# Altium project Test1.PrjPcb
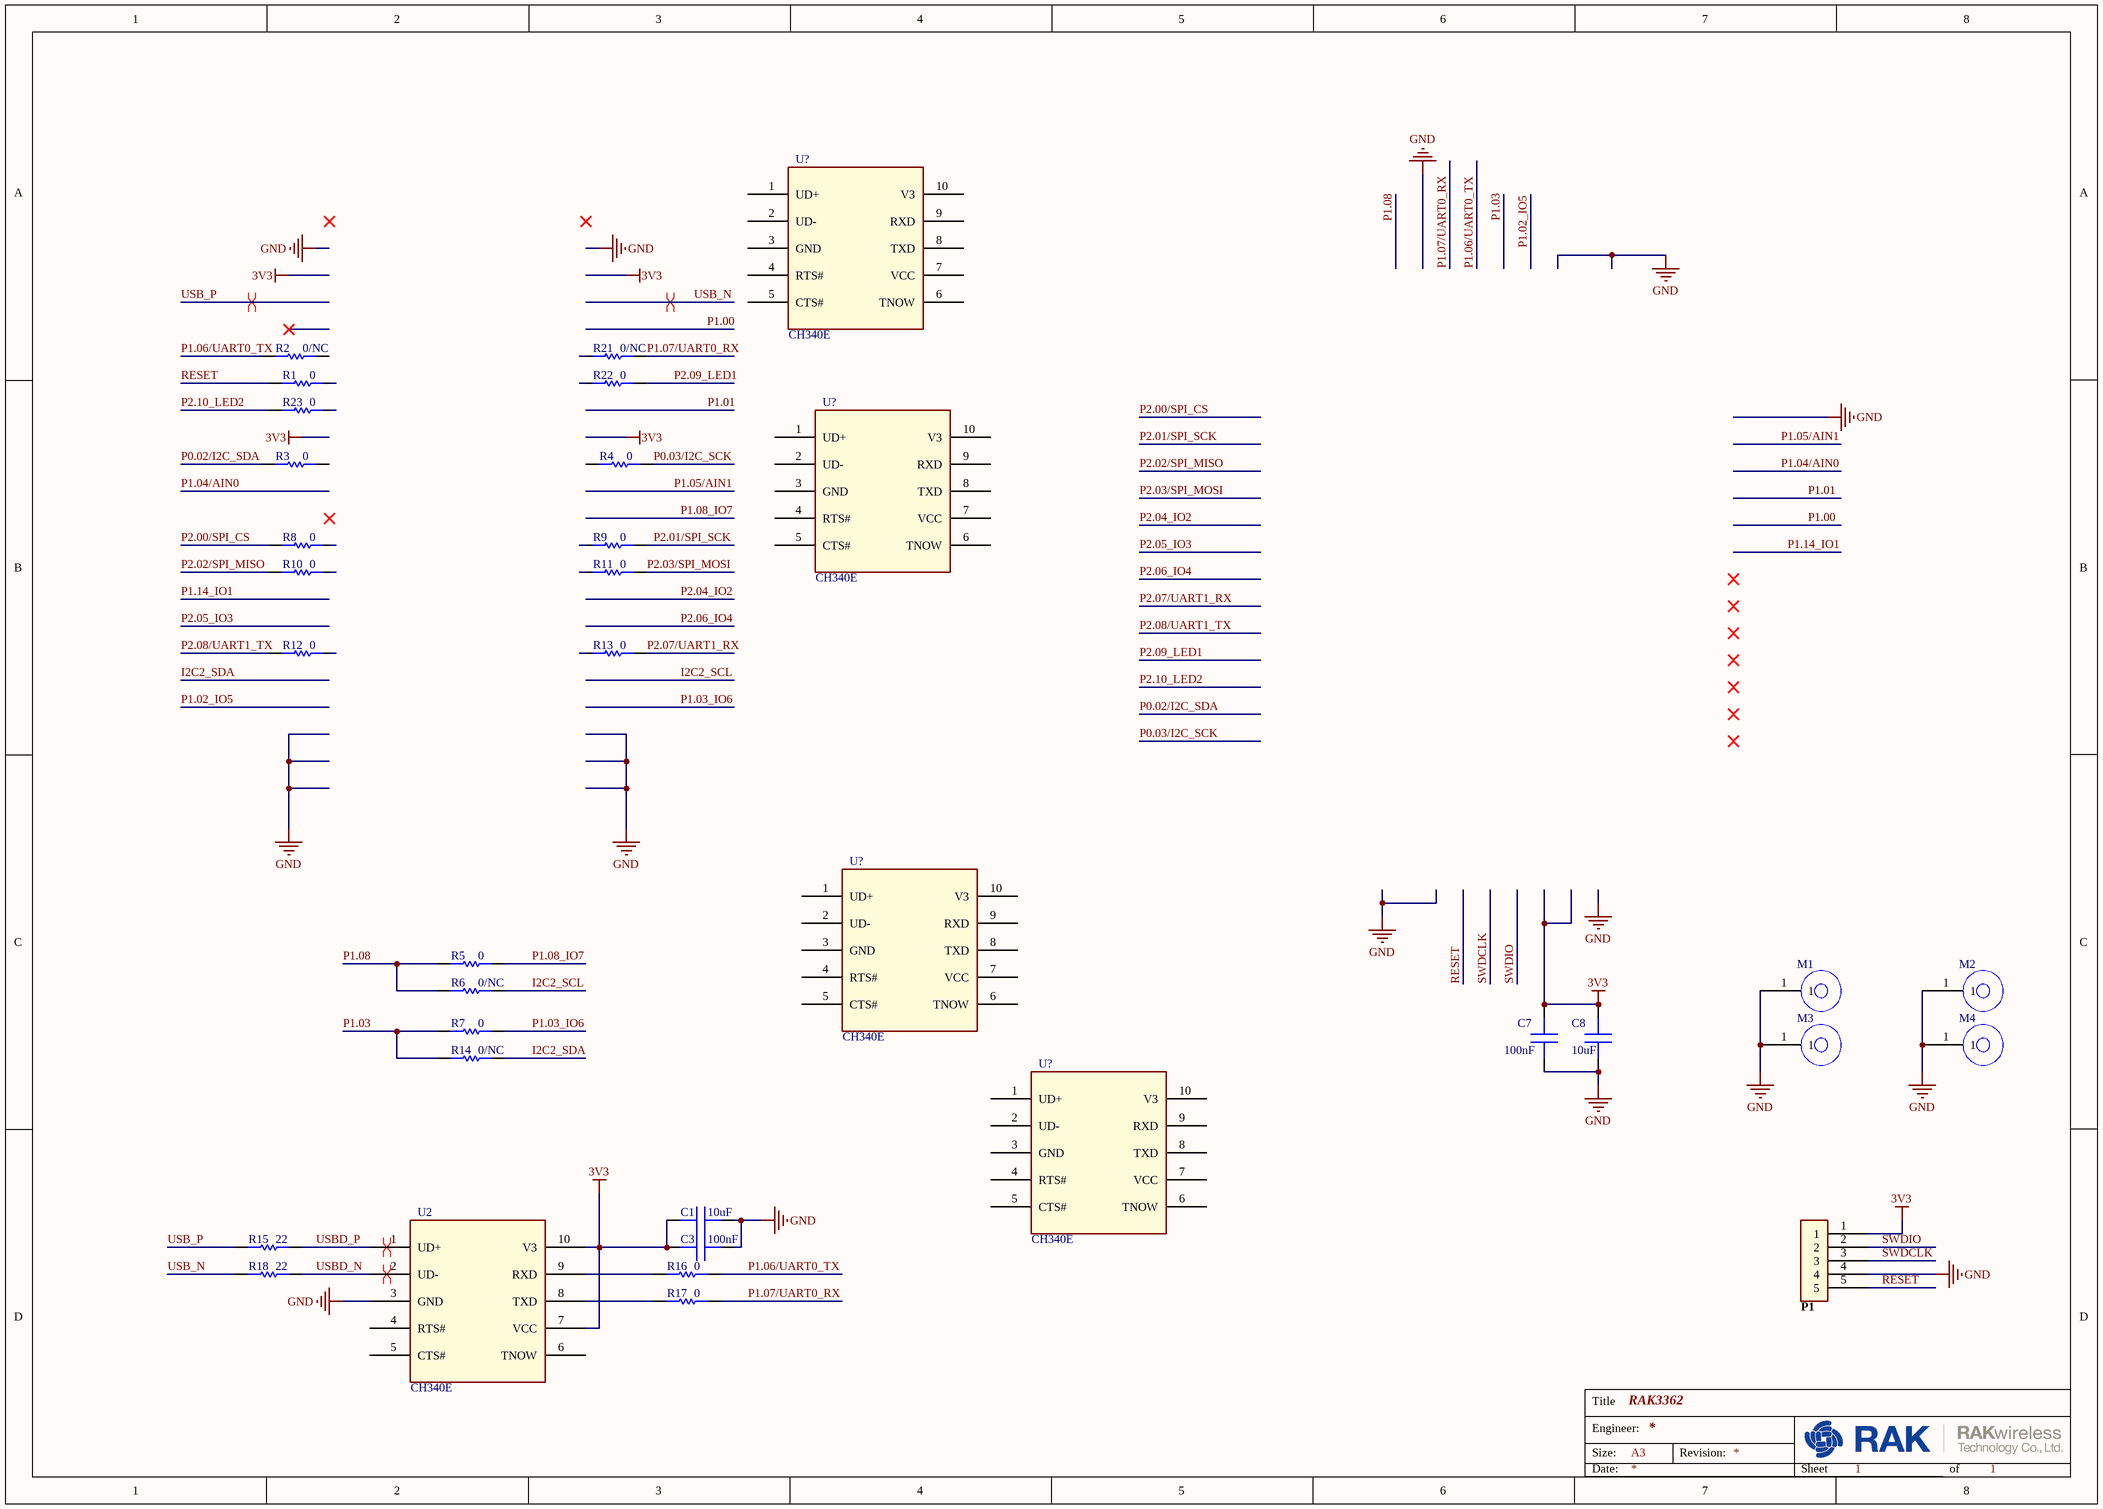
[diagram p0: RAK3362_VB_260330.SchDoc]
1 sheet, 35 parts. Net scope: global (net labels, ports and power ports of the same name join across sheets).
Board file: RAK3362_VB_260329_1.PcbDoc

## Sheet RAK3362_VB_260330.SchDoc: RAK3362
size A3; SheetNumber: 1; SheetTotal: 1

### Parts
(Parts that share a designator on the sheet are numbered #1, #2 ... from top to bottom, then left to right.)
C1  value 10uF  [sc0402]  (hidden comment: CAPACITOR NP)
C3  value 100nF  [sc0402]  (hidden comment: CAPACITOR NP)
C7  value 100nF  [sc0402]  (hidden comment: CAPACITOR NP)
C8  value 10uF  [sc0402]  (hidden comment: CAPACITOR NP)
M1  LuoDingK  [M15_26]  (value not drawn)
M2  LuoDingK  [M15_26]  (value not drawn)
M3  LuoDingK  [M15_26]  (value not drawn)
M4  LuoDingK  [M15_26]  (value not drawn)
P1  Header1X5  [PH254-115-05]  (value not drawn)
R1  value 0  [sr0402]  (hidden comment: RESISTOR)
R2  value 0/NC  [sr0402]  (hidden comment: RESISTOR)
R3  value 0  [sr0402]  (hidden comment: RESISTOR)
R4  value 0  [sr0402]  (hidden comment: RESISTOR)
R5  value 0  [sr0402]  (hidden comment: RESISTOR)
R6  value 0/NC  [sr0402]  (hidden comment: RESISTOR)
R7  value 0  [sr0402]  (hidden comment: RESISTOR)
R8  value 0  [sr0402]  (hidden comment: RESISTOR)
R9  value 0  [sr0402]  (hidden comment: RESISTOR)
R10  value 0  [sr0402]  (hidden comment: RESISTOR)
R11  value 0  [sr0402]  (hidden comment: RESISTOR)
R12  value 0  [sr0402]  (hidden comment: RESISTOR)
R13  value 0  [sr0402]  (hidden comment: RESISTOR)
R14  value 0/NC  [sr0402]  (hidden comment: RESISTOR)
R15  value 22  [sr0402]  (hidden comment: RESISTOR)
R16  value 0  [sr0402]  (hidden comment: RESISTOR)
R17  value 0  [sr0402]  (hidden comment: RESISTOR)
R18  value 22  [sr0402]  (hidden comment: RESISTOR)
R21  value 0/NC  [sr0402]  (hidden comment: RESISTOR)
R22  value 0  [sr0402]  (hidden comment: RESISTOR)
R23  value 0  [sr0402]  (hidden comment: RESISTOR)
U2  CH340E  [MSOP-10]
U?#1  CH340E  [MSOP-10]
U?#2  CH340E  [MSOP-10]
U?#3  CH340E  [MSOP-10]
U?#4  CH340E  [MSOP-10]

### Nets
3V3: C1.2(NEG) C3.1(POS) C7.2(NEG) C8.2(NEG) P1.1 U2.7(VCC) U2.10(V3)
GND: C1.1(POS) C3.2(NEG) C7.1(POS) C8.1(POS) M1.1 M2.1 M3.1 M4.1 P1.4 U2.3(GND)
I2C2_SCL: R6.1
I2C2_SDA: R14.1
P0.02/I2C_SDA: R3.2
P0.03/I2C_SCK: R4.1
P1.03: R7.2 R14.2
P1.03_IO6: R7.1
P1.06/UART0_TX: R2.2 R16.1
P1.07/UART0_RX: R17.1 R21.1
P1.08: R5.2 R6.2
P1.08_IO7: R5.1
P2.00/SPI_CS: R8.2
P2.01/SPI_SCK: R9.1
P2.02/SPI_MISO: R10.2
P2.03/SPI_MOSI: R11.1
P2.07/UART1_RX: R13.1
P2.08/UART1_TX: R12.2
P2.09_LED1: R22.1
P2.10_LED2: R23.2
RESET: P1.5 R1.2
SWDCLK: P1.3
SWDIO: P1.2
USB_N: R18.2
USB_P: R15.2
USBD_N: R18.1 U2.2(UD-)
USBD_P: R15.1 U2.1(UD+)
NetR16_2: R16.2 U2.9(RXD)
NetR17_2: R17.2 U2.8(TXD)

Not connected (* = marked no-connect by the designer): R1 1; R2 1; R3 1; R4 2; R8 1; R9 2; R10 1; R11 2; R12 1; R13 2; R21 2; R22 2; R23 1; U2 4(RTS#) 5(CTS#) 6(TNOW); U?#1 1(UD+) 2(UD-) 3(GND) 4(RTS#) 5(CTS#) 6(TNOW) 7(VCC) 8(TXD) 9(RXD) 10(V3); U?#2 1(UD+) 2(UD-) 3(GND) 4(RTS#) 5(CTS#) 6(TNOW) 7(VCC) 8(TXD) 9(RXD) 10(V3); U?#3 1(UD+) 2(UD-) 3(GND) 4(RTS#) 5(CTS#) 6(TNOW) 7(VCC) 8(TXD) 9(RXD) 10(V3); U?#4 1(UD+) 2(UD-) 3(GND) 4(RTS#) 5(CTS#) 6(TNOW) 7(VCC) 8(TXD) 9(RXD) 10(V3)

### Layout directives
differential pair: USB_N, USB_P, USBD_N, USBD_P

### Notes on the sheet
- Title
- Size:
- Engineer:
- A3
- Revision:
- Date:
- Sheet
- of

### Library data of the parts
C1 C8 = 0807C004: Capacitor-10V-10uF-±20%-X5R-0402; MANUFACTURER: YAGEO; Part Number: CC0402MRX5R6BB106; TOLERANCE: ±20%; SYMNAME: CAP; VOLTAGE: 10V; RAK Code: KRAKBJ0807C004; Classification: SMD Ceramic Capacitor; CODE: 0807C004
C3 C7 = 08070561: Capacitor-10V-100nF-±10%-X5R -0402; MANUFACTURER: YAGEO; Part Number: CC0402KRX5R6BB104; TOLERANCE: ±10%; SYMNAME: CAP; VOLTAGE: 10V; RAK Code: K3CA10402KA402; Classification: SMD Ceramic Capacitor; CODE: 08070561
M1-M4 = 2699C004: Mounting Hole-Hole 1.5mm-Pad 2.6mm; Value: NC; Code: 2699C004; Classification: Mounting Hole
R1-R14 R16 R17 R21-R23 = 07090800: Resistor-0Ω-1A-50mΩMAX-0402; MANUFACTURER: YAGEO; Part Number: RC0402JR-070RL; RAK Code: K3RS00001JA402; Tolerance: < 50mΩ; Classification: Thick Film Resistor; CODE: 07090800
R15 R18 = 07090803: Resistor-1/16W-22Ω-±5%-0402; MANUFACTURER: YAGEO; Part Number: RC0402JR-0722RL; RAK Code: KRAKBJ07090803; Tolerance: ±5%; Classification: Thick Film Resistor; CODE: 07090803
U2 U?#1-U?#4 = 3809C005: Interface IC-USB to UART-CH340E-USB 2.0-one UART port-MSOP-10; Manufacturer: QH01; RAK Code: KRAKBJ3809C005; Value: CH340E; Code: 3809C005; Part Number: CH340E; Classification: Interface IC